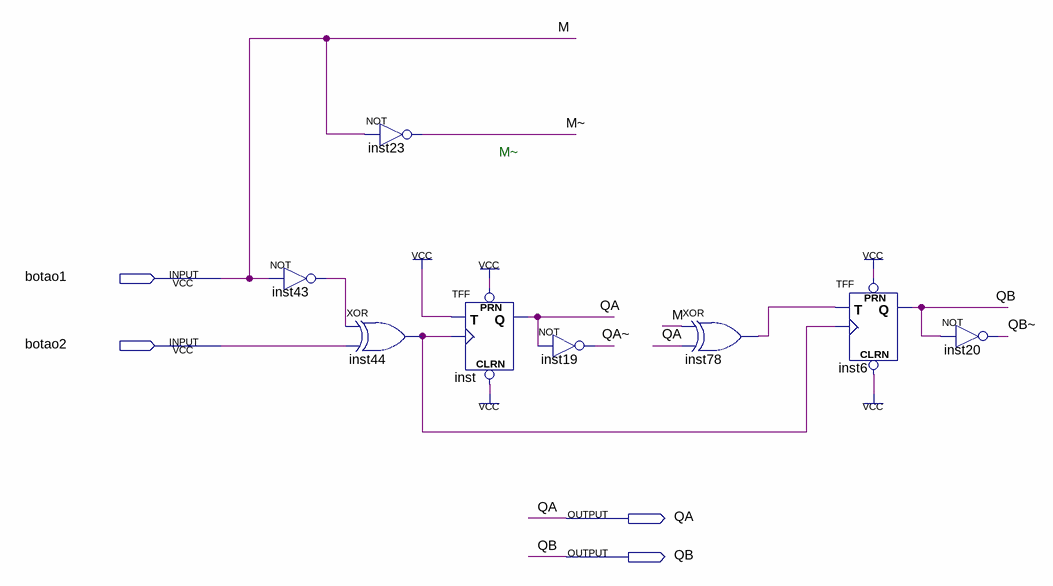
[diagram p0: schematic sheet]
// Quartus schematic Contador_updown2bits.bdf as structural Verilog: 8 symbols, 4 pins
module Contador_updown2bits (
  input  botao1,
  input  botao2,
  output QA,
  output QB
);

  wire inst43_out, inst44_out, inst78_out, \M~ , \QA~ , \QB~ ;

  not inst43 (inst43_out, botao1);
  xor inst44 (inst44_out, inst43_out, botao2);
  not inst23 (\M~ , botao1);
  TFF inst (.PRN(1'b1), .CLRN(1'b1), .T(1'b1), .CLK(inst44_out), .Q(QA));
  not inst19 (\QA~ , QA);
  xor inst78 (inst78_out, botao1, QA);
  TFF inst6 (.PRN(1'b1), .CLRN(1'b1), .T(inst78_out), .CLK(inst44_out), .Q(QB));
  not inst20 (\QB~ , QB);

  // Other names for the same wires on the sheet: M = botao1

  // Notes on the sheet:
  //   M~
endmodule
